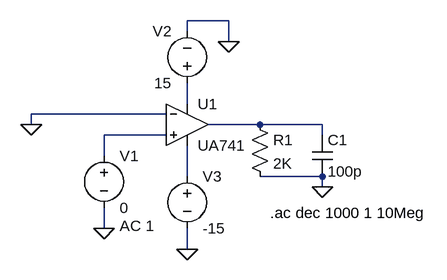
[diagram p0: schematic Prueba modelo 741.asc]
Prueba modelo 741.asc, the LTspice schematic file:
Version 4
SHEET 1 880 680
WIRE 224 16 160 16
WIRE 160 32 160 16
WIRE 224 48 224 16
WIRE 160 144 160 112
WIRE 128 160 -80 160
WIRE -80 176 -80 160
WIRE 272 176 192 176
WIRE 368 176 272 176
WIRE 128 192 32 192
WIRE 368 192 368 176
WIRE 32 224 32 192
WIRE 160 256 160 208
WIRE 368 256 272 256
WIRE 368 272 368 256
WIRE 32 336 32 304
WIRE 160 368 160 336
FLAG 368 272 0
FLAG 32 336 0
FLAG 224 48 0
FLAG 160 368 0
FLAG -80 176 0
SYMBOL AutoGenerated\\UA741 160 176 R0
SYMATTR InstName U1
SYMBOL res 256 160 R0
SYMATTR InstName R1
SYMATTR Value 2K
SYMBOL voltage 32 208 R0
WINDOW 123 24 124 Left 2
WINDOW 39 0 0 Left 0
SYMATTR InstName V1
SYMATTR Value 0
SYMATTR Value2 AC 1
SYMBOL voltage 160 128 R180
WINDOW 0 24 96 Left 2
WINDOW 3 24 16 Left 2
SYMATTR InstName V2
SYMATTR Value 15
SYMBOL voltage 160 240 R0
SYMATTR InstName V3
SYMATTR Value -15
SYMBOL cap 352 192 R0
SYMATTR InstName C1
SYMATTR Value 100p
TEXT 288 312 Left 2 !.ac dec 1000 1 10Meg

The netlist it stands for:
* Prueba modelo 741.asc
* U1: UA741 (symbol AutoGenerated\UA741 not available, pins judged from their places): In+=N003 In-=0 V+=N001 V-=N004 OUT=N002
R1 N002 0 2K
V1 N003 0 0 AC 1
V2 N001 0 15
V3 N004 0 -15
C1 N002 0 100p
.ac dec 1000 1 10Meg
.backanno
.end